# Altium schematic sheet Power.SchDoc
size A4; SheetNumber: 13; SheetTotal: 13
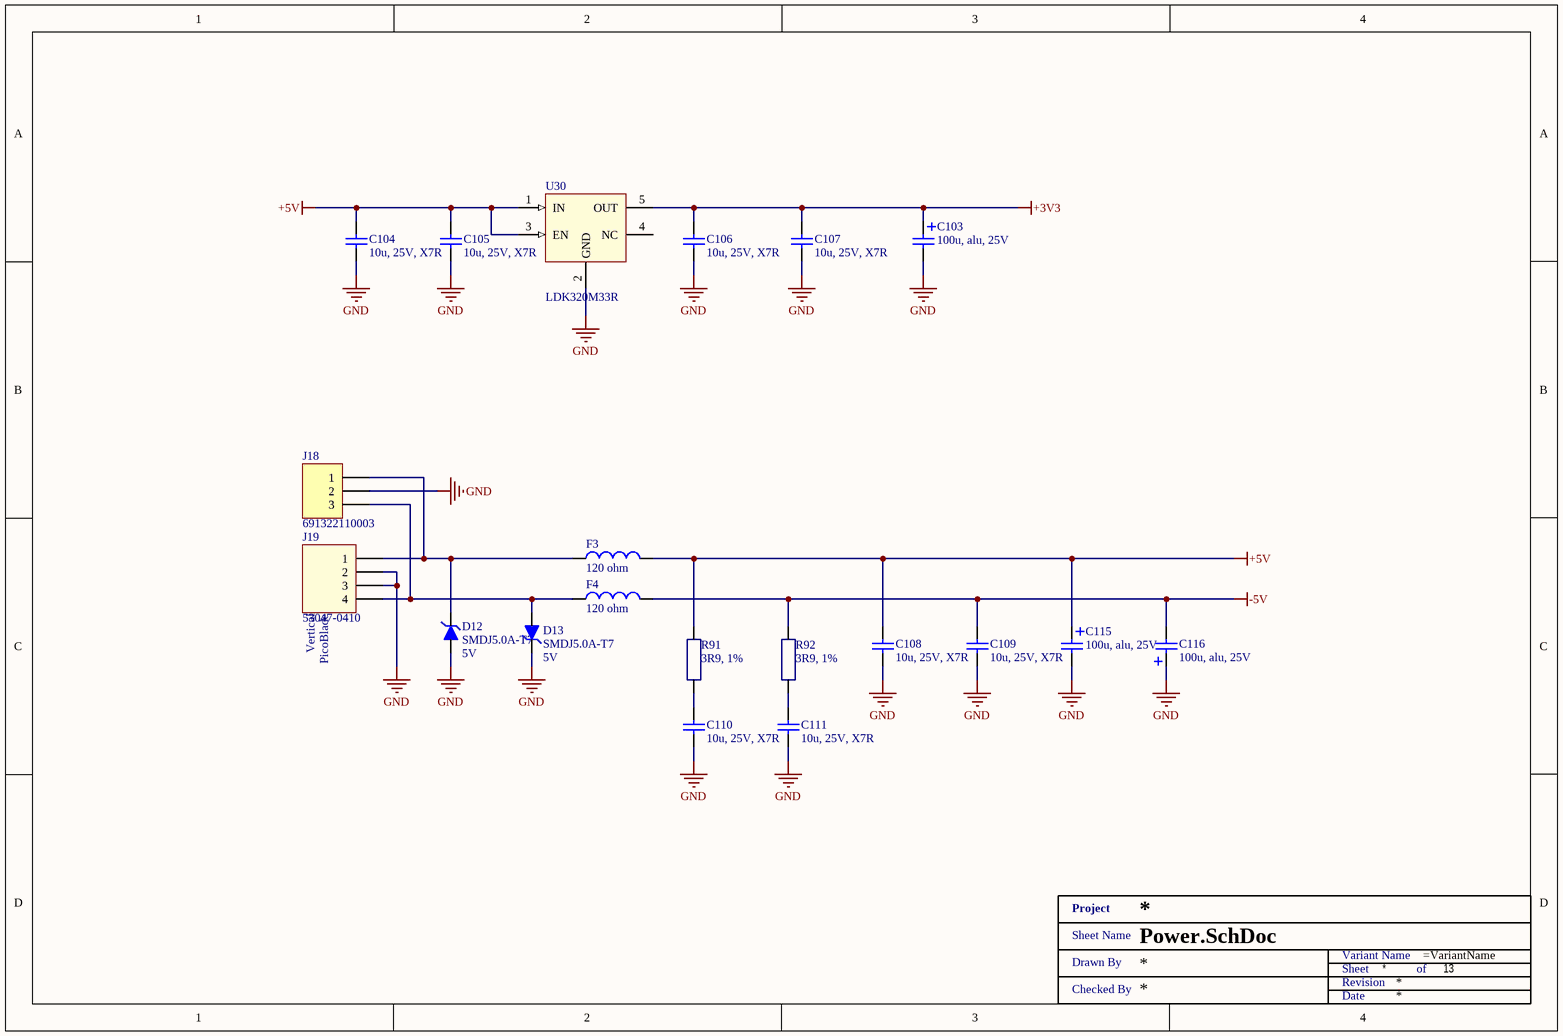
[diagram p0: Power.SchDoc]

## Parts
C103  100u, alu, 25V  [WCAP-ATLI_6.3x11x2.5]
C104  10u, 25V, X7R  [SMD1206]
C105  10u, 25V, X7R  [SMD1206]
C106  10u, 25V, X7R  [SMD1206]
C107  10u, 25V, X7R  [SMD1206]
C108  10u, 25V, X7R  [SMD1206]
C109  10u, 25V, X7R  [SMD1206]
C110  10u, 25V, X7R  [SMD1206]
C111  10u, 25V, X7R  [SMD1206]
C115  100u, alu, 25V  [WCAP-ATLI_6.3x11x2.5]
C116  100u, alu, 25V  [WCAP-ATLI_6.3x11x2.5]
D12  SMDJ5.0A-T7  Reverse Standoff Voltage: 5V  [DO-214AB]
D13  SMDJ5.0A-T7  Reverse Standoff Voltage: 5V  [DO-214AB]
F3  120 ohm  [SMD0805 - R]
F4  120 ohm  [SMD0805 - R]
J18  691322110003  [691322110003]
J19  53047-0410  [530470410]
R91  3R9, 1%  [SMD0603 - R]
R92  3R9, 1%  [SMD0603 - R]
U30  LDK320M33R  [SOT23-5]
XX?  Title 1  (value not drawn)  (graphical)

## Nets
+3V3: C103.1 C106.2 C107.2 U30.5(OUT)
+5V: C104.2 C105.2 C108.2 C115.1 F3.2 R91.2 U30.1(IN) U30.3(EN)
-5V: C109.2 C116.2 F4.2 R92.2
GND: C103.2 C104.1 C105.1 C106.1 C107.1 C108.1 C109.1 C110.1 C111.1 C115.2 C116.1 D12.2 D13.1 J18.2 J19.2 J19.3 U30.2(GND)
NetC110_2: C110.2 R91.1
NetC111_2: C111.2 R92.1
NetD12_1: D12.1 F3.1 J18.1 J19.1
NetD13_2: D13.2 F4.1 J18.3 J19.4

Not connected (* = marked no-connect by the designer): U30 4(NC)

## Notes on the sheet
- (in symbol 53047-0410) Vertical; PicoBlade
- (in symbol Title 1) Project; Sheet Name; Variant Name; Drawn By; Sheet; of; Revision; Checked By; Date

## Library data of the parts
C103 C115 C116 = 860010473007: CAP 100 UF 20% 25 V; Manufacturer: Wurth Electronics; Material: Aluminium; Capacitance: 100uF; Polarity: Polar; Ripple Current: 209mA; Life (Hours): 2000Hour; Supplier 1: Mouser; Supplier Part Number 1: 710-860010473007; Manufacturer Part Number: 860010473007; RoHS: Yes; Category: Aluminum Electrolytic Capacitors; Stock 1: 1494; Pricing 1: 1=0.14000, 10=0.13400, 25=0.13400, 50=0.11200, 100=0.09800, 250=0.08700 (USD); Mount: Through Hole; Case/Package: Radial; Min Operating Temperature: -40°C; Max Operating Temperature: 85°C; Tolerance: 20%; Voltage Rating (DC): 25V; Package Quantity: 1500; Packaging: Tape and Reel; Voltage Rating: 25V; Diameter: 6.3mm; Height: 11mm; Lead Pitch: 0.098inch; Height - Seated (Max): 0.492inch; REACH SVHC: Unknown; ComponentLink1URL: https://datasheet.ciiva.com/48693/001280151-da-01-en-wcap-atg8-alu-elec-caps-860010473007-48693591.pdf?src-supplier=Conrad; ComponentLink1Description: https://datasheet.ciiva.com/48693/001280151-da-01-en-wcap-atg8-alu-elec-caps-860010473007-48693591.pdf?src-supplier=Conrad; Supplier 2: Farnell; Supplier Part Number 2: 2465675; Supplier 3: Digi-Key; Supplier Part Number 3: 732-8630-1-ND
C104-C111 = GRM31CR71E106KA12L: MURATA - GRM31CR71E106KA12L - CAP, MLCC, X7R, 10UF, 25V, 1206; Manufacturer: MURATA; Manufacturer Part Number: GRM31CR71E106KA12L; RoHS: YES; Stock 1: 8848; Pricing 1: 5=0.278, 50=0.185, 250=0.139, 500=0.134, 1000=0.128 (GBP); ComponentLink1URL: http://www.farnell.com/datasheets/2048746.pdf; ComponentLink1Description: http://www.farnell.com/datasheets/2048746.pdf; Capacitance: 10u; Dielectric: X7R; Supplier 1: Mouser; Supplier Part Number 1: 81-GRM31CR71E106KA12; Supplier 2: Farnell; Supplier Part Number 2: 1828837; Supplier 3: Digi-Key; Supplier Part Number 3: 490-6518-1-ND
D12 D13 = SMDJ5.0A-T7: TVS DIODE 5V 9.2V DO214AB; Manufacturer: Littelfuse; Peak Pulse Current: 326.1A; Number of Unidirectional Channels: 1; Min Breakdown Voltage: 6.4V; Peak Pulse Power: 3kW; Power Line Protection: No; Supplier 1: Mouser; Supplier Part Number 1: 576-SMDJ5.0A-T7; Manufacturer Part Number: SMDJ5.0A-T7; RoHS: Yes; Category: TVS Diodes; Stock 1: 117; Pricing 1: 1=0.84000, 10=0.71500, 50=0.71500, 100=0.56800, 500=0.46100, 1000=0.46100, 10000=0.46100 (USD); Mount: Surface Mount; Number of Pins: 2; Min Operating Temperature: -55°C; Max Operating Temperature: 150°C; Packaging: Tape and Reel; Package Quantity: 500; Resistor Type: Zener; Clamping Voltage: 9.2V; Lead Free: Contains Lead; ComponentLink1URL: http://components.arrow.com/part/dataview/51478447S87545N3675?src-supplier=Arrow+Electronics; ComponentLink1Description: http://components.arrow.com/part/dataview/51478447S87545N3675?src-supplier=Arrow+Electronics; ComponentLink2URL: http://www.mouser.com/ds/2/240/Littelfuse_TVS_Diode_SMCJ_HRA_Datasheet.pdf-693424.pdf?src-supplier=Mouser; ComponentLink2Description: http://www.mouser.com/ds/2/240/Littelfuse_TVS_Diode_SMCJ_HRA_Datasheet.pdf-693424.pdf?src-supplier=Mouser; Supplier 2: Digi-Key; Supplier Part Number 2: 18-SMDJ5.0A-T7CT-ND; Supplier 3: Arrow Electronics; Supplier Part Number 3: SMDJ5.0A-T7
F3 F4 = 742792023: WURTH ELEKTRONIK - 742792023 - FERRITE BEAD, 0.03OHM, 3A, 0805; Impedance @ 100MHz: 120; Ferrite Case Style: 0805 [2012 Metric]; DC Current Rating: 3; DC Resistance Max: 0.03; Impedance Tolerance: ± 25%; Ferrite Mounting: SMD; Resistance: 0.03ohm<!--FANDB--><div class="features-and-benefits-container"><div class="features-and-benefits-description"><span class="features-benefits-value">The 742792023 is a SMD EMI Suppression Ferrite Bead with 0805 case and reliable Ni-Sn electrodes. It can be put directly on the printed circuit board. It offers excellent anti-EMI properties and low DC resistance. Placed very close next to the interference source even with smallest size 0402, maximal impedance at 1000; Manufacturer: WURTH ELEKTRONIK; Manufacturer Part Number: 742792023; RoHS: YES; Stock 1: 4283; Pricing 1: 1=0,123, 50=0,112, 100=0,103, 500=0,0937, 1000=0,0877, 2000=0,0846 (GBP); Product Range: -; Automotive Qualification Standard: -; Packaging: Cut Tape; ComponentLink1URL: http://www.farnell.com/datasheets/1695980.pdf; ComponentLink1Description: http://www.farnell.com/datasheets/1695980.pdf; ComponentLink2URL: http://www.farnell.com/cad/1670054.zip; ComponentLink2Description: http://www.farnell.com/cad/1670054.zip; Supplier 1: Mouser; Supplier Part Number 1: 710-742792023; Supplier 2: Farnell; Supplier Part Number 2: 1635732; Supplier 3: Digi-Key; Supplier Part Number 3: 732-1613-1-ND
J18 = 691322110003: WR-TBL Serie 3221 - 3.50 mm Horizontal PCB Header, 03p; Pitch: 3.5 mm; Published Date: Jan 2017; Publisher: Wurth Elektronik; ComponentLink1Description: Manufacturer; ComponentLink1URL: http://www.we-online.de; ComponentLink2Description: Datasheet; ComponentLink2URL: http://katalog.we-online.de/em/datasheet/6913221100xx.pdf; Part Number: 691322110003; Pin Number: 03p; Supplier 1: Digi-Key; Supplier Part Number 1: 732-2770-ND; Supplier 2: Farnell; Supplier Part Number 2: 1841316
J19 = 53047-0410: 1.25mm Pitch, PicoBlade PCB Header, Single Row, Vertical, Through Hole, Tin Plating, Friction Lock, 4 Circuits, Tray, 2.30mm PC Tail Length; Manufacturer: Molex; Manufacturer Part Number: 0530470410; Number of Positions: 4; Max Voltage Rating (AC): 125V; Contact Resistance: 20mR; Connector Type: Blade Pin; RoHS: Yes; Category: Headers and Wire Housings; Stock 4: 7971; Pricing 4: 1=0,27000, 10=0,23400, 100=0,18000, 500=0,15400, 1000=0,13000, 5000=0,11200, 10000=0,10400 (USD); Mount: Through Hole; Housing Material: Nylon; Contact Plating: Tin; Contact Material: Bronze; Color: Natural; Housing Color: White; Min Operating Temperature: -40°C; Max Operating Temperature: 85°C; Termination: Solder; Number of Contacts: 4; Packaging: Tray; Number of Rows: 1; Orientation: Straight; Length: 6.75mm; Pitch: 1.25mm; Contact Mating Length: 0.089inch; Depth: 3.2mm; ComponentLink1URL: https://datasheet.ciiva.com/3934/87920530470410-pcb-headers-3934064.pdf?src-supplier=Arrow; ComponentLink1Description: https://datasheet.ciiva.com/3934/87920530470410-pcb-headers-3934064.pdf?src-supplier=Arrow; Supplier 1: Mouser; Supplier Part Number 1: 538-53047-0410; Supplier 2: Farnell; Supplier Part Number 2: 9733060; Supplier 3: Digi-Key; Supplier Part Number 3: WM1733-ND; Supplier 4: Avnet; Supplier Part Number 4: 0530470410
R91 R92 = RC0603FR-073R9L: YAGEO - RC0603FR-073R9L - RES, 3R9, 1%, 0.1W, 0603, THICK FILM; Voltage Rating (DC): 50V; Power Rating: 100mW; Temperature Coefficient: 200ppm/°C; Supplier 1: Mouser; Supplier Part Number 1: 603-RC0603FR-073R9L; Manufacturer: Yageo; Manufacturer Part Number: RC0603FR-073R9L; Stock 1: 33978; Pricing 1: 1 = 0.15000, 10 = 0.03600, 50 = 0.03600, 100 = 0.01200, 1000 = 0.00900, 5000 = 0.00600, 10000 = 0.00600, 25000 = 0.00500, 50000 = 0.00400 (USD); RoHS: Yes; Case/Package: 0603; Number of Pins: 2; Case Code (Imperial): 0603; Case Code (Metric): 1608; Min Operating Temperature: -55°C; Max Operating Temperature: 155°C; Resistance: 3R9; Tolerance: 1%; Voltage Rating: 50V; Packaging: Tape and Reel; Composition: Thick Film; Number of Terminations: 2; Termination: SMD/SMT; Military Standard: Not; Max Power Dissipation: 100mW; Features: Moisture Resistant; Length: 1.6mm; Height: 0.45mm; Width: 0.8mm; Depth: 0.8mm; REACH SVHC: Unknown; ComponentLink1URL: https://datasheet.ciiva.com/11819/0900766b80c66297-11819668.pdf?src-supplier=RSComponents; ComponentLink1Description: https://datasheet.ciiva.com/11819/0900766b80c66297-11819668.pdf?src-supplier=RSComponents; ComponentLink2URL: https://datasheet.ciiva.com/12575/rc0603-272842-12575846.pdf?src-supplier=Mouser; ComponentLink2Description: https://datasheet.ciiva.com/12575/rc0603-272842-12575846.pdf?src-supplier=Mouser; Supplier 2: Farnell; Supplier Part Number 2: 9238190; Supplier 3: Arrow; Supplier Part Number 3: RC0603FR-073R9L
U30 = LDK320M33R: IC REG LINEAR 200MA SOT23-5; Manufacturer: STMicroelectronics; Output Configuration: Positive; Output Type: Fixed; Voltage - Input (Max): 18V; Voltage - Output (Min/Fixed): 3.3V; Voltage Dropout (Max): 0.35V @ 200mA; PSRR: 88dB (120Hz); Control Features: Enable; Protection Features: Over Current, Over Temperature; Manufacturer Part Number: LDK320M33R; RoHS: RoHS Compliant; Category: Integrated Circuits (ICs); Stock 1: 5592; Pricing 1: 1=0.85, 10=0.748, 100=0.5733, 500=0.4532, 1000=0.36256 (USD); Packaging: Cut Tape (CT); Part Status: Active; Current - Output: 200mA; Operating Temperature: -40°C ~ 125°C (TJ); Mounting Type: Surface Mount; Package / Case: SC-74A, SOT-753; Supplier Device Package: SOT-23-5; ComponentLink1URL: http://www.st.com/content/ccc/resource/technical/document/datasheet/0e/0c/26/c9/a4/d4/4b/a1/DM00236470.pdf/files/DM00236470.pdf/jcr:content/translations/en.DM00236470.pdf; ComponentLink1Description: http://www.st.com/content/ccc/resource/technical/document/datasheet/0e/0c/26/c9/a4/d4/4b/a1/DM00236470.pdf/files/DM00236470.pdf/jcr:content/translations/en.DM00236470.pdf; Supplier 1: Mouser; Supplier Part Number 1: 511-LDK320M33R; Supplier 2: Farnell; Supplier Part Number 2: 3130011; Supplier 3: Digi-Key; Supplier Part Number 3: 497-17034-1-ND